# Altium project MICB.PrjPcb
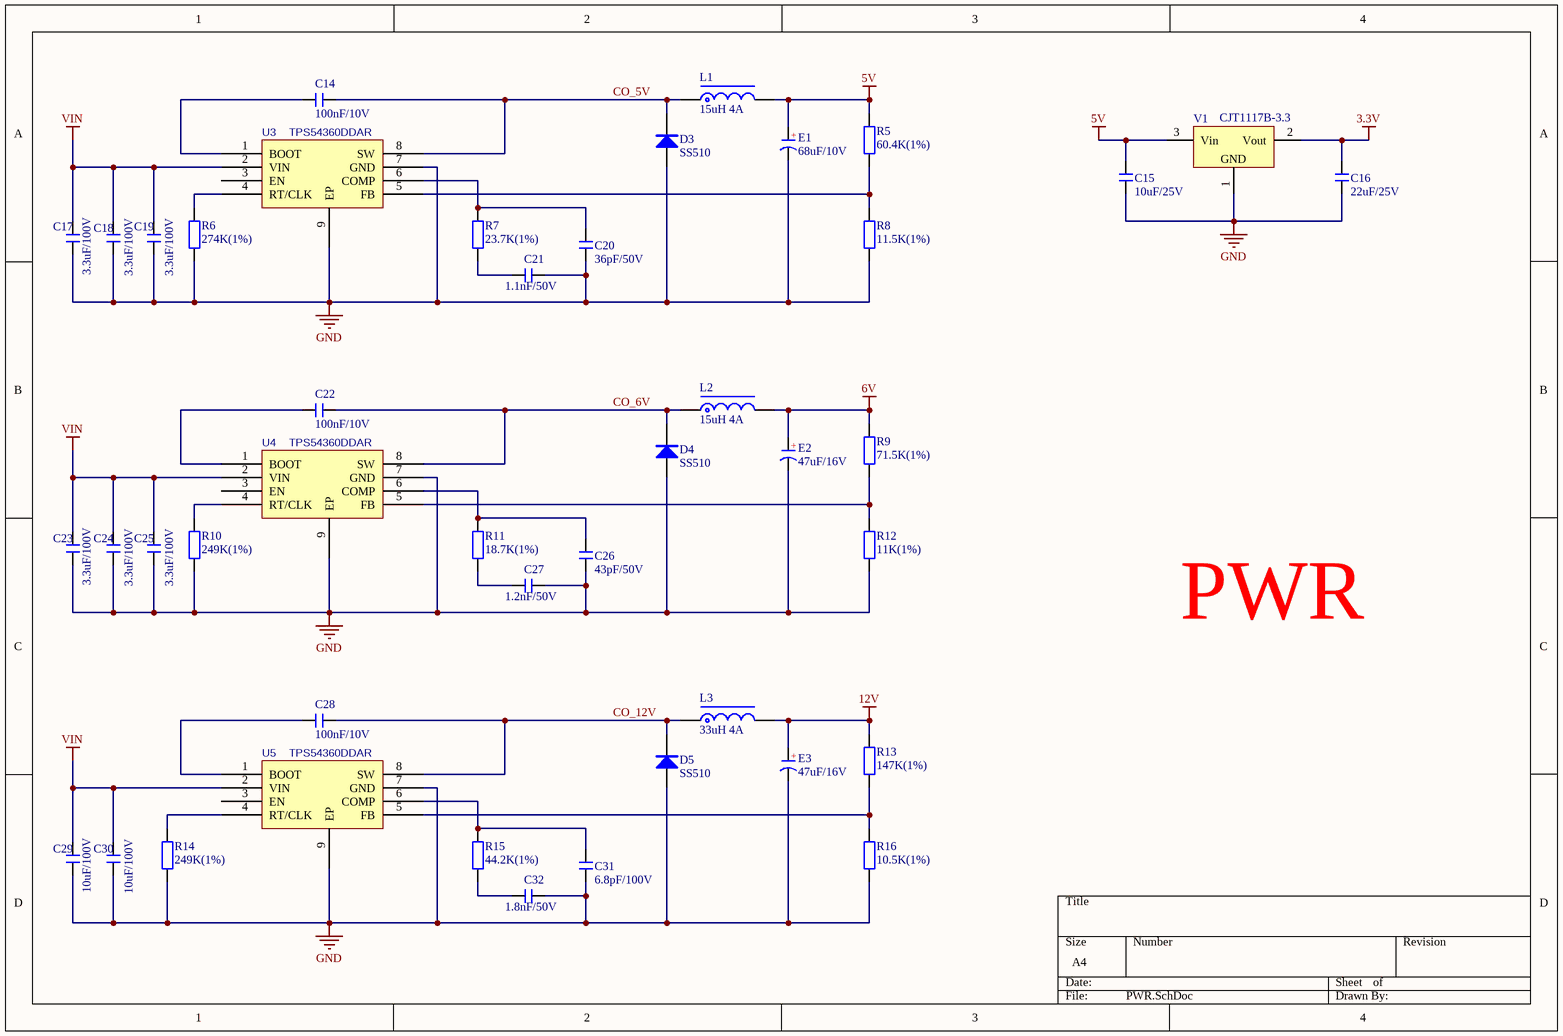
[diagram p0: PWR.SchDoc]
10 sheets, 244 parts. Net scope: global (net labels, ports and power ports of the same name join across sheets).
Board file: MICB.PcbDoc
Sheets:
  PWR.SchDoc
  MCU.SchDoc
  Vout.SchDoc
  Ain.SchDoc
  Iout.SchDoc
  PWM.SchDoc
  Serial.SchDoc
  RLY.SchDoc
  ETH.SchDoc
  CONN.SchDoc

## Sheet PWR.SchDoc
size A4; SheetNumber: 1; SheetTotal: 10

### Parts
C14  100nF/10V  [C 0603_L]
C15  10uF/25V  [C 0603_L]
C16  22uF/25V  [C 0603_L]
C17  3.3uF/100V  [C 1210_L]
C18  3.3uF/100V  [C 1210_L]
C19  3.3uF/100V  [C 1210_L]
C20  36pF/50V  [C 0603_L]
C21  1.1nF/50V  [C 0603_L]
C22  100nF/10V  [C 0603_L]
C23  3.3uF/100V  [C 1210_L]
C24  3.3uF/100V  [C 1210_L]
C25  3.3uF/100V  [C 1210_L]
C26  43pF/50V  [C 0603_L]
C27  1.2nF/50V  [C 0603_L]
C28  100nF/10V  [C 0603_L]
C29  10uF/100V  [C 1210_L]
C30  10uF/100V  [C 1210_L]
C31  6.8pF/100V  [C 0603_L]
C32  1.8nF/50V  [C 0603_L]
D3  SS510  [SMA]
D4  SS510  [SMA]
D5  SS510  [SMA]
E1  68uF/10V  [CD B(3528)]
E2  47uF/16V  [CD B(3528)]
E3  47uF/16V  [CD B(3528)]
L1  15uH 4A  [L-SMD-1040]
L2  15uH 4A  [L-SMD-1040]
L3  33uH 4A  [L-SMD-1040]
R5  60.4K(1%)  [R 0603_L]
R6  274K(1%)  [R 0603_L]
R7  23.7K(1%)  [R 0603_L]
R8  11.5K(1%)  [R 0603_L]
R9  71.5K(1%)  [R 0603_L]
R10  249K(1%)  [R 0603_L]
R11  18.7K(1%)  [R 0603_L]
R12  11K(1%)  [R 0603_L]
R13  147K(1%)  [R 0603_L]
R14  249K(1%)  [R 0603_L]
R15  44.2K(1%)  [R 0603_L]
R16  10.5K(1%)  [R 0603_L]
U3  TPS54360DDAR  [SOP-8EP]
U4  TPS54360DDAR  [SOP-8EP]
U5  TPS54360DDAR  [SOP-8EP]
V1  CJT1117B-3.3  [SOT223_L]

### Nets
3.3V: C16.2 V1.2(Vout)
5V: C15.2 E1.1(A) L1.2 R5.2 V1.3(Vin)
6V: E2.1(A) L2.2 R9.2
12V: E3.1(A) L3.2 R13.2
GND: C15.1 C16.1 C17.1 C18.1 C19.1 C20.2 C21.2 C23.1 C24.1 C25.1 C26.2 C27.2 C29.1 C30.1 C31.2 C32.2 D3.1(A) D4.1(A) D5.1(A) E1.2(K) E2.2(K) E3.2(K) R6.1 R8.1 R10.1 R12.1 R14.1 R16.1 U3.7(GND) U3.9(EP) U4.7(GND) U4.9(EP) U5.7(GND) U5.9(EP) V1.1(GND)
VIN: C17.2 C18.2 C19.2 C23.2 C24.2 C25.2 C29.2 C30.2 U3.2(VIN) U4.2(VIN) U5.2(VIN)
CO_5V: C14.1 D3.2(K) L1.1 U3.8(SW)
CO_6V: C22.1 D4.2(K) L2.1 U4.8(SW)
CO_12V: C28.1 D5.2(K) L3.1 U5.8(SW)
NetC14_2: C14.2 U3.1(BOOT)
NetC20_1: C20.1 R7.2 U3.6(COMP)
NetC21_1: C21.1 R7.1
NetC22_2: C22.2 U4.1(BOOT)
NetC26_1: C26.1 R11.2 U4.6(COMP)
NetC27_1: C27.1 R11.1
NetC28_2: C28.2 U5.1(BOOT)
NetC31_1: C31.1 R15.2 U5.6(COMP)
NetC32_1: C32.1 R15.1
NetR5_1: R5.1 R8.2 U3.5(FB)
NetR6_2: R6.2 U3.4(RT/CLK)
NetR9_1: R9.1 R12.2 U4.5(FB)
NetR10_2: R10.2 U4.4(RT/CLK)
NetR13_1: R13.1 R16.2 U5.5(FB)
NetR14_2: R14.2 U5.4(RT/CLK)

Not connected (* = marked no-connect by the designer): U3 3(EN); U4 3(EN); U5 3(EN)

### Notes on the sheet
- PWR
- (in symbol C-CD) +

### Library data of the parts
C14-C32 = C: 无极性贴片电容; 版权归属: 源创客; BOM名称: 无极性贴片电容; 学习资源: www.ooocke.com
D3-D5 = SS210: 肖特基二极管; 版权归属: 源创客; BOM名称: 肖特基二极管; 学习资源: www.ooocke.com
E1-E3 = C-CD: 贴片钽电容; 版权归属: 源创客; BOM名称: 贴片钽电容; 学习资源: www.ooocke.com
L1-L3 = L-CDRH: 一体成型电感; BOM名称: 功率屏蔽电感; 版权归属: 源创客; 学习资源: www.ooocke.com
R5-R16 = R: 贴片电阻; 版权归属: 源创客; BOM名称: 贴片电阻; 学习资源: www.ooocke.com
U3-U5 = TPS54360DDAR: BOM_Manufacturer: TI; BOM_Supplier: LCSC; BOM_Manufacturer Part: TPS54360DDAR; BOM_Supplier Part: C44377; BOM_JLCPCB Part Class: Extended Part; spicePre: U; spiceSymbolName: TPS54360DDAR
V1 = AMS1117: 三端稳压芯片; BOM名称: 稳压芯片; 版权归属: 源创客; 学习资源: www.ooocke.com

## Sheet MCU.SchDoc
size A4; SheetNumber: 2; SheetTotal: 10
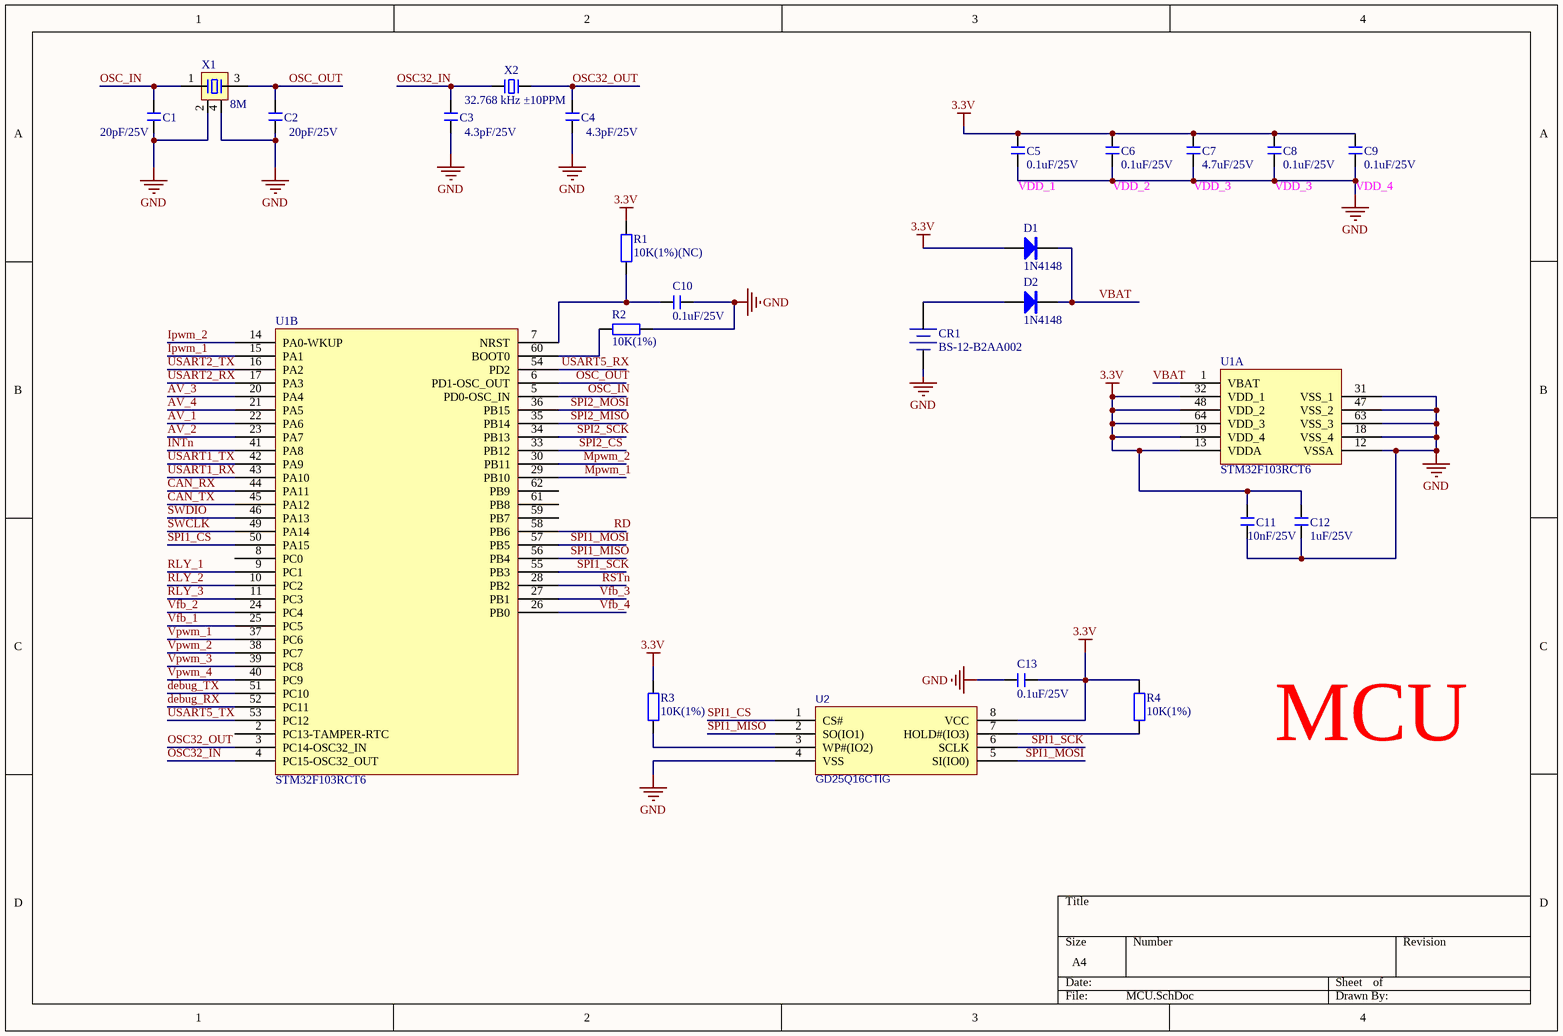
[diagram p1: MCU.SchDoc]

### Parts
C1  20pF/25V  [C 0603_L]
C2  20pF/25V  [C 0603_L]
C3  4.3pF/25V  [C 0603_L]
C4  4.3pF/25V  [C 0603_L]
C5  0.1uF/25V  [C 0603_L]
C6  0.1uF/25V  [C 0603_L]
C7  4.7uF/25V  [C 0603_L]
C8  0.1uF/25V  [C 0603_L]
C9  0.1uF/25V  [C 0603_L]
C10  0.1uF/25V  [C 0603_L]
C11  10nF/25V  [C 0603_L]
C12  1uF/25V  [C 0603_L]
C13  0.1uF/25V  [C 0603_L]
CR1  BS-12-B2AA002  [CR1220_B]
D1  1N4148  [SOD-323]
D2  1N4148  [SOD-323]
R1  10K(1%)(NC)  [R 0603_L]
R2  10K(1%)  [R 0603_L]
R3  10K(1%)  [R 0603_L]
R4  10K(1%)  [R 0603_L]
U1  STM32F103RCT6  [LQFP64 10x10_N]  (parts A,B of 2)
U2  GD25Q16CTIG  [SOP-8]
X1  8M  [OSC 3225-4P]
X2  32.768 kHz ±10PPM  [OSC 3215-2P]

### Nets
3.3V: C5.2 C6.2 C7.2 C8.2 C9.2 C11.1 C12.1 C13.2 D1.1(A) R1.2 R3.1 R4.1 U1.13(VDDA) U1.19(VDD_4) U1.32(VDD_1) U1.48(VDD_2) U1.64(VDD_3) U2.8(VCC)
GND: C1.2 C2.2 C3.2 C4.2 C5.1 C6.1 C7.1 C8.1 C9.1 C10.1 C11.2 C12.2 C13.1 CR1.2(DC-) R2.1 U1.12(VSSA) U1.18(VSS_4) U1.31(VSS_1) U1.47(VSS_2) U1.63(VSS_3) U2.4(VSS) X1.2 X1.4
AV_1: U1.22(PA6)
AV_2: U1.23(PA7)
AV_3: U1.20(PA4)
AV_4: U1.21(PA5)
CAN_RX: U1.44(PA11)
CAN_TX: U1.45(PA12)
debug_RX: U1.52(PC11)
debug_TX: U1.51(PC10)
INTn: U1.41(PA8)
Ipwm_1: U1.15(PA1)
Ipwm_2: U1.14(PA0-WKUP)
Mpwm_1: U1.29(PB10)
Mpwm_2: U1.30(PB11)
OSC32_IN: C3.1 U1.4(PC15-OSC32_OUT) X2.1
OSC32_OUT: C4.1 U1.3(PC14-OSC32_IN) X2.2
OSC_IN: C1.1 U1.5(PD0-OSC_IN) X1.1
OSC_OUT: C2.1 U1.6(PD1-OSC_OUT) X1.3
RD: U1.58(PB6)
RLY_1: U1.9(PC1)
RLY_2: U1.10(PC2)
RLY_3: U1.11(PC3)
RSTn: U1.28(PB2)
SPI1_CS: U1.50(PA15) U2.1(CS#)
SPI1_MISO: U1.56(PB4) U2.2(SO(IO1))
SPI1_MOSI: U1.57(PB5) U2.5(SI(IO0))
SPI1_SCK: U1.55(PB3) U2.6(SCLK)
SPI2_CS: U1.33(PB12)
SPI2_MISO: U1.35(PB14)
SPI2_MOSI: U1.36(PB15)
SPI2_SCK: U1.34(PB13)
SWCLK: U1.49(PA14)
SWDIO: U1.46(PA13)
USART1_RX: U1.43(PA10)
USART1_TX: U1.42(PA9)
USART2_RX: U1.17(PA3)
USART2_TX: U1.16(PA2)
USART5_RX: U1.54(PD2)
USART5_TX: U1.53(PC12)
VBAT: D1.2(K) D2.2(K) U1.1(VBAT)
Vfb_1: U1.25(PC5)
Vfb_2: U1.24(PC4)
Vfb_3: U1.27(PB1)
Vfb_4: U1.26(PB0)
Vpwm_1: U1.37(PC6)
Vpwm_2: U1.38(PC7)
Vpwm_3: U1.39(PC8)
Vpwm_4: U1.40(PC9)
NetC10_2: C10.2 R1.1 U1.7(NRST)
NetCR1_1: CR1.1(DC+) D2.1(A)
NetR2_2: R2.2 U1.60(BOOT0)
NetR3_2: R3.2 U2.3(WP#(IO2))
NetR4_2: R4.2 U2.7(HOLD#(IO3))

Not connected (* = marked no-connect by the designer): U1 2(PC13-TAMPER-RTC) 8(PC0) 59(PB7) 61(PB8) 62(PB9)

### Notes on the sheet
- (near C5) VDD_1
- (near C6) VDD_2
- (near C7) VDD_3
- (near C8) VDD_3
- (near C9) VDD_4
- MCU

### Library data of the parts
C1-C13 = C: 无极性贴片电容; 版权归属: 源创客; BOM名称: 无极性贴片电容; 学习资源: www.ooocke.com
CR1 = CR-3V: MYOUNG(美阳) 电池底座 适用电池:CR1220; BOM名称: 微型电池; 版权归属: 源创客; 学习资源: www.ooocke.com
D1 D2 = 1N4148: 高速开关二极管; 版权归属: 源创客; BOM名称: 高速开关二极管; 学习资源: www.ooocke.com
R1-R4 = R: 贴片电阻; 版权归属: 源创客; BOM名称: 贴片电阻; 学习资源: www.ooocke.com
U2 = GD25Q16CTIG: spi flash; BOM_Manufacturer: XTX; BOM_Manufacturer Part: XT25F32BSOIGU-S; Contributor: LCSC; BOM_Supplier: LCSC; BOM_Supplier Part: C558851; BOM_JLCPCB Part Class: Extended Part; spicePre: U; spiceSymbolName: XT25F32BSOIGU-S
X1 = XTAL-4P: 4脚无源晶振; 版权归属: 源创客; BOM名称: 4脚无源晶振; 学习资源: www.ooocke.com
X2 = XTAL-2P: 2脚无源脚晶振 型号Q13FC13500005; 版权归属: 源创客; BOM名称: 2脚无源脚晶振; 学习资源: www.ooocke.com

## Sheet Vout.SchDoc
size A4; SheetNumber: 3; SheetTotal: 10
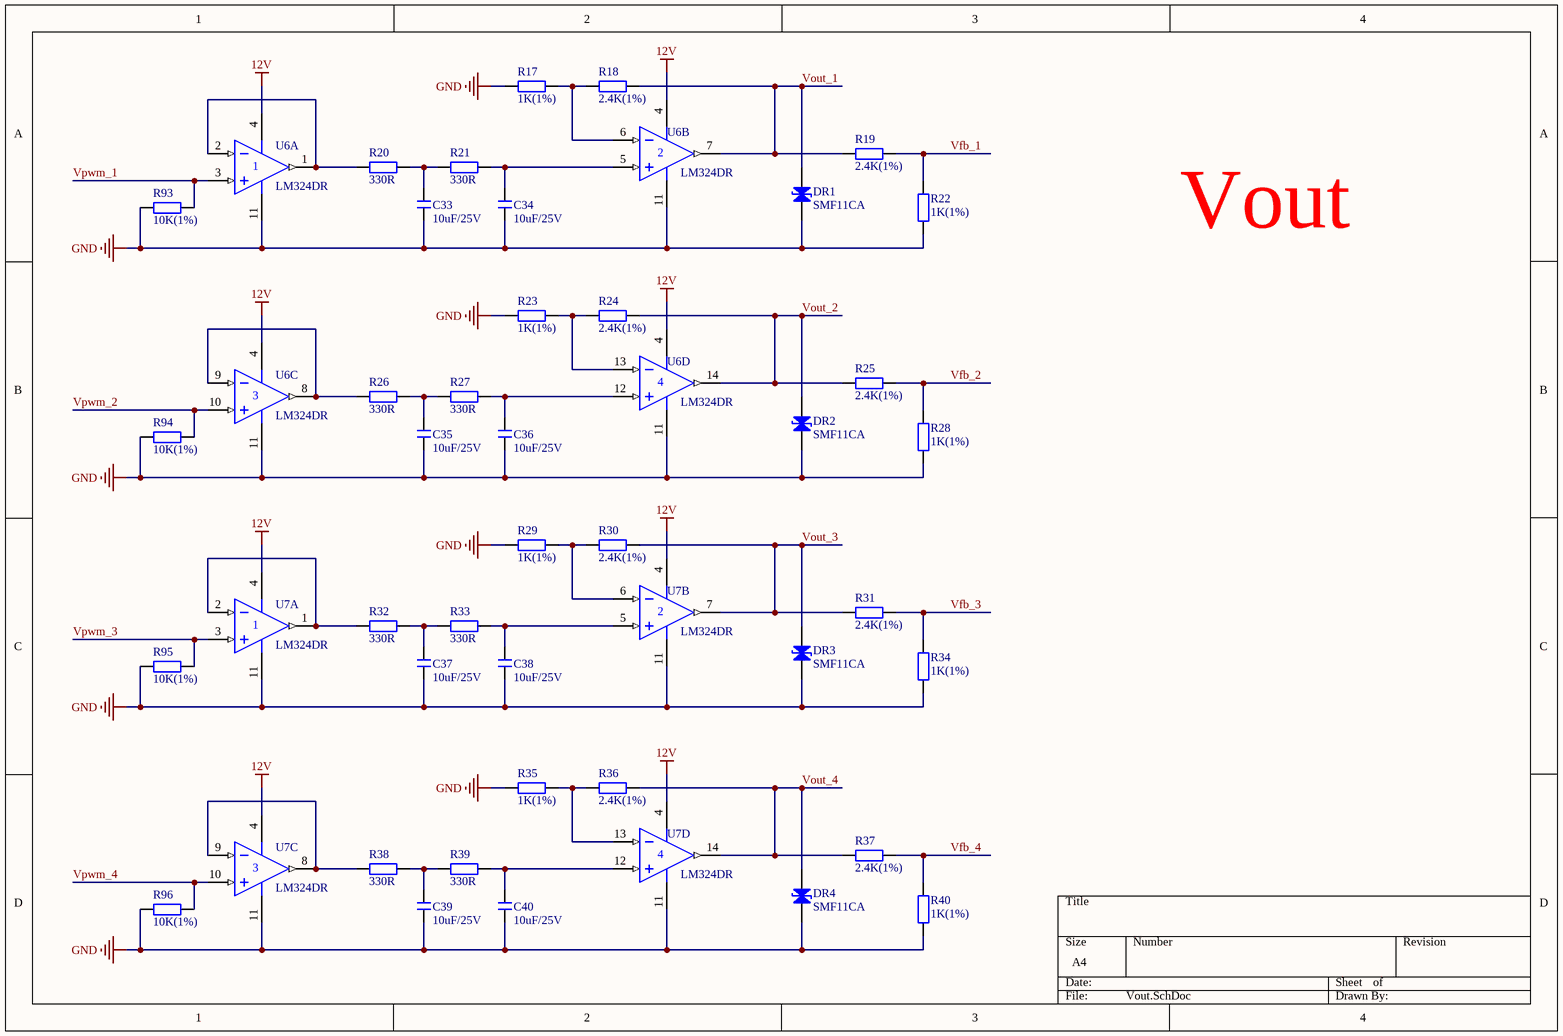
[diagram p2: Vout.SchDoc]

### Parts
C33  10uF/25V  [C 0603_L]
C34  10uF/25V  [C 0603_L]
C35  10uF/25V  [C 0603_L]
C36  10uF/25V  [C 0603_L]
C37  10uF/25V  [C 0603_L]
C38  10uF/25V  [C 0603_L]
C39  10uF/25V  [C 0603_L]
C40  10uF/25V  [C 0603_L]
DR1  SMF11CA  [SOD-123F]
DR2  SMF11CA  [SOD-123F]
DR3  SMF11CA  [SOD-123F]
DR4  SMF11CA  [SOD-123F]
R17  1K(1%)  [R 0603_L]
R18  2.4K(1%)  [R 0603_L]
R19  2.4K(1%)  [R 0603_L]
R20  330R  [R 0603_L]
R21  330R  [R 0603_L]
R22  1K(1%)  [R 0603_L]
R23  1K(1%)  [R 0603_L]
R24  2.4K(1%)  [R 0603_L]
R25  2.4K(1%)  [R 0603_L]
R26  330R  [R 0603_L]
R27  330R  [R 0603_L]
R28  1K(1%)  [R 0603_L]
R29  1K(1%)  [R 0603_L]
R30  2.4K(1%)  [R 0603_L]
R31  2.4K(1%)  [R 0603_L]
R32  330R  [R 0603_L]
R33  330R  [R 0603_L]
R34  1K(1%)  [R 0603_L]
R35  1K(1%)  [R 0603_L]
R36  2.4K(1%)  [R 0603_L]
R37  2.4K(1%)  [R 0603_L]
R38  330R  [R 0603_L]
R39  330R  [R 0603_L]
R40  1K(1%)  [R 0603_L]
R93  10K(1%)  [R 0603_L]
R94  10K(1%)  [R 0603_L]
R95  10K(1%)  [R 0603_L]
R96  10K(1%)  [R 0603_L]
U6  LM324DR  [D014_N]  (parts A,B,C,D of 4)
U7  LM324DR  [D014_N]  (parts A,B,C,D of 4)

### Nets
12V: U6.4(V+) U7.4(V+)
GND: C33.1 C34.1 C35.1 C36.1 C37.1 C38.1 C39.1 C40.1 DR1.2(K) DR2.2(K) DR3.2(K) DR4.2(K) R17.2 R22.1 R23.2 R28.1 R29.2 R34.1 R35.2 R40.1 R93.1 R94.1 R95.1 R96.1 U6.11(V-) U7.11(V-)
Vfb_1: R19.1 R22.2
Vfb_2: R25.1 R28.2
Vfb_3: R31.1 R34.2
Vfb_4: R37.1 R40.2
Vout_1: DR1.1(A) R18.1 R19.2 U6.7(OUT)
Vout_2: DR2.1(A) R24.1 R25.2 U6.14(OUT)
Vout_3: DR3.1(A) R30.1 R31.2 U7.7(OUT)
Vout_4: DR4.1(A) R36.1 R37.2 U7.14(OUT)
Vpwm_1: R93.2 U6.3(IN+)
Vpwm_2: R94.2 U6.10(IN+)
Vpwm_3: R95.2 U7.3(IN+)
Vpwm_4: R96.2 U7.10(IN+)
NetC33_2: C33.2 R20.1 R21.2
NetC34_2: C34.2 R21.1 U6.5(IN+)
NetC35_2: C35.2 R26.1 R27.2
NetC36_2: C36.2 R27.1 U6.12(IN+)
NetC37_2: C37.2 R32.1 R33.2
NetC38_2: C38.2 R33.1 U7.5(IN+)
NetC39_2: C39.2 R38.1 R39.2
NetC40_2: C40.2 R39.1 U7.12(IN+)
NetR17_1: R17.1 R18.2 U6.6(IN-)
NetR20_2: R20.2 U6.1(OUT) U6.2(IN-)
NetR23_1: R23.1 R24.2 U6.13(IN-)
NetR26_2: R26.2 U6.8(OUT) U6.9(IN-)
NetR29_1: R29.1 R30.2 U7.6(IN-)
NetR32_2: R32.2 U7.1(OUT) U7.2(IN-)
NetR35_1: R35.1 R36.2 U7.13(IN-)
NetR38_2: R38.2 U7.8(OUT) U7.9(IN-)

### Notes on the sheet
- Vout

### Library data of the parts
C33-C40 = C: 无极性贴片电容; 版权归属: 源创客; BOM名称: 无极性贴片电容; 学习资源: www.ooocke.com
DR1-DR4 = DR: 瞬态电压抑制二极管; 版权归属: 源创客; BOM名称: 瞬态电压抑制二极管; 学习资源: www.ooocke.com
R17-R40 R93-R96 = R: 贴片电阻; 版权归属: 源创客; BOM名称: 贴片电阻; 学习资源: www.ooocke.com
U6 U7 = LM324DR: Quadruple Operational Amplifier; Published: 15-Apr-2002; LatestRevisionDate: 13-Apr-2006; LatestRevisionNote: IPC-7351 Footprint Added.; DatasheetVersion: Jan-1989; PackageVersion: Jan-1998; PackageReference: D014; Publisher: Altium Limited; PackageDescription: 14-Pin Small Outline Integrated Circuit 1.27 mm Pitch; Code_IPC: SOIC127P600-14; ComponentLink1Description: Manufacturer Link; ComponentLink1URL: http://www.ti.com/; ComponentLink2Description: Datasheet; ComponentLink2URL: http://www-s.ti.com/sc/ds/lm324.pdf

## Sheet Ain.SchDoc
size A4; SheetNumber: 4; SheetTotal: 10
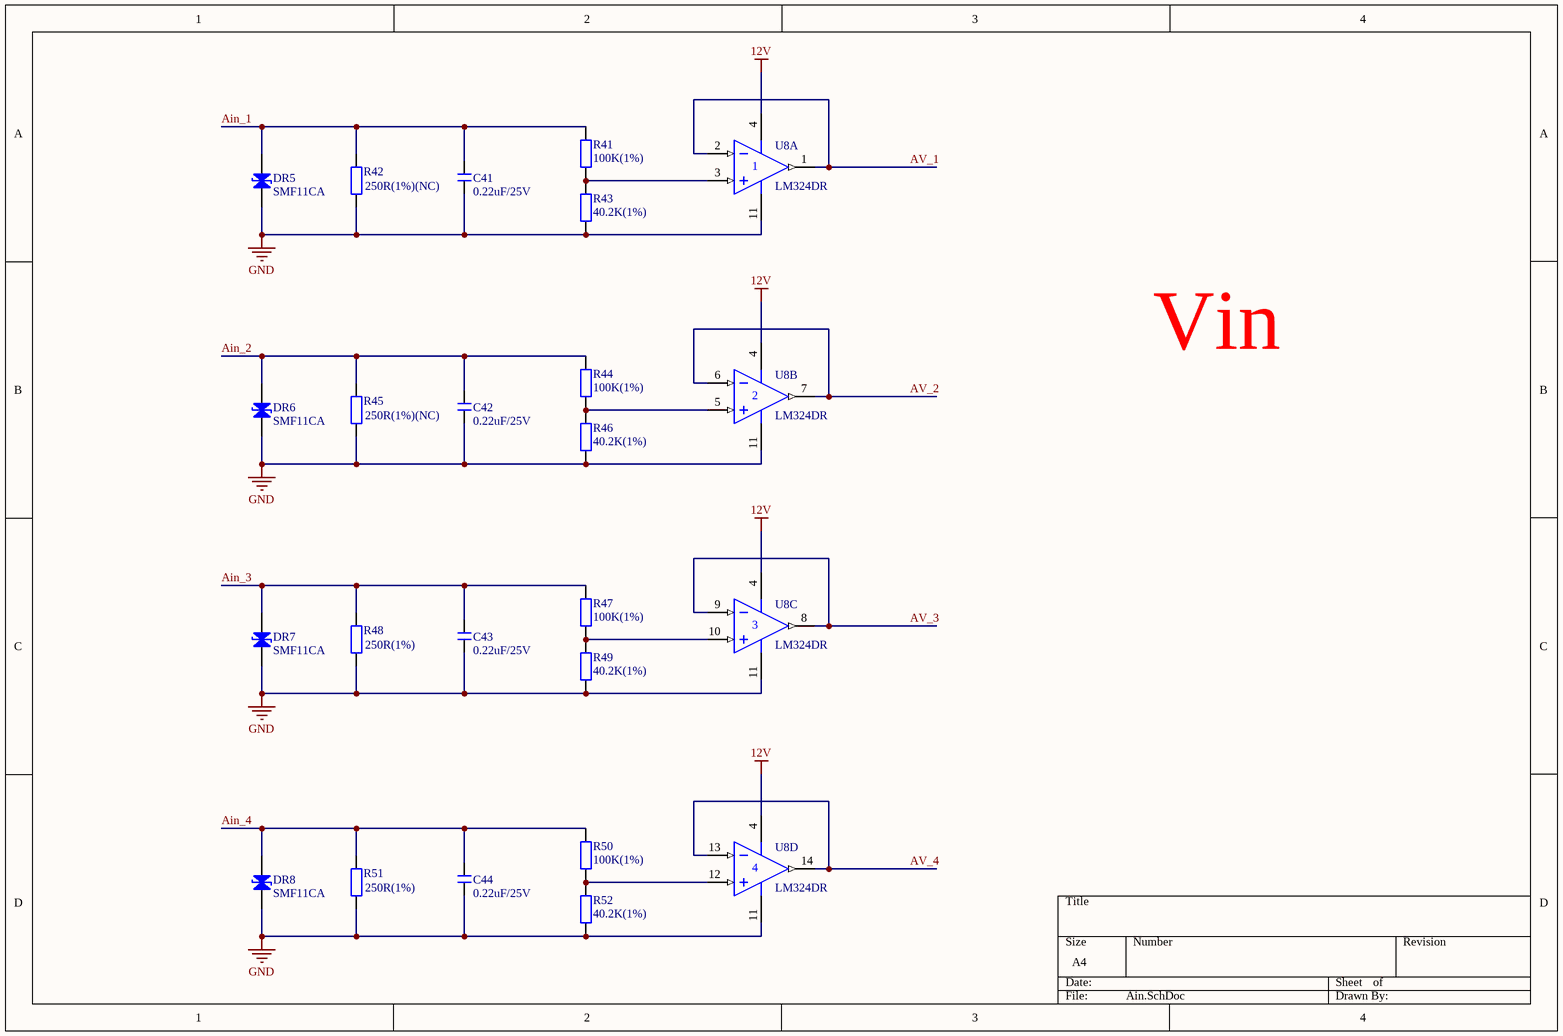
[diagram p3: Ain.SchDoc]

### Parts
C41  0.22uF/25V  [C 0603_L]
C42  0.22uF/25V  [C 0603_L]
C43  0.22uF/25V  [C 0603_L]
C44  0.22uF/25V  [C 0603_L]
DR5  SMF11CA  [SOD-123F]
DR6  SMF11CA  [SOD-123F]
DR7  SMF11CA  [SOD-123F]
DR8  SMF11CA  [SOD-123F]
R41  100K(1%)  [R 0603_L]
R42  250R(1%)(NC)  [R 0603_L]
R43  40.2K(1%)  [R 0603_L]
R44  100K(1%)  [R 0603_L]
R45  250R(1%)(NC)  [R 0603_L]
R46  40.2K(1%)  [R 0603_L]
R47  100K(1%)  [R 0603_L]
R48  250R(1%)  [R 0603_L]
R49  40.2K(1%)  [R 0603_L]
R50  100K(1%)  [R 0603_L]
R51  250R(1%)  [R 0603_L]
R52  40.2K(1%)  [R 0603_L]
U8  LM324DR  [D014_N]  (parts A,B,C,D of 4)

### Nets
12V: U8.4(V+)
GND: C41.1 C42.1 C43.1 C44.1 DR5.2(K) DR6.2(K) DR7.2(K) DR8.2(K) R42.1 R43.1 R45.1 R46.1 R48.1 R49.1 R51.1 R52.1 U8.11(V-)
Ain_1: C41.2 DR5.1(A) R41.2 R42.2
Ain_2: C42.2 DR6.1(A) R44.2 R45.2
Ain_3: C43.2 DR7.1(A) R47.2 R48.2
Ain_4: C44.2 DR8.1(A) R50.2 R51.2
AV_1: U8.1(OUT) U8.2(IN-)
AV_2: U8.6(IN-) U8.7(OUT)
AV_3: U8.8(OUT) U8.9(IN-)
AV_4: U8.13(IN-) U8.14(OUT)
NetR41_1: R41.1 R43.2 U8.3(IN+)
NetR44_1: R44.1 R46.2 U8.5(IN+)
NetR47_1: R47.1 R49.2 U8.10(IN+)
NetR50_1: R50.1 R52.2 U8.12(IN+)

### Notes on the sheet
- Vin

### Library data of the parts
C41-C44 = C: 无极性贴片电容; 版权归属: 源创客; BOM名称: 无极性贴片电容; 学习资源: www.ooocke.com
DR5-DR8 = DR: 瞬态电压抑制二极管; 版权归属: 源创客; BOM名称: 瞬态电压抑制二极管; 学习资源: www.ooocke.com
R41-R52 = R: 贴片电阻; 版权归属: 源创客; BOM名称: 贴片电阻; 学习资源: www.ooocke.com
U8 = LM324DR: Quadruple Operational Amplifier; Published: 15-Apr-2002; LatestRevisionDate: 13-Apr-2006; LatestRevisionNote: IPC-7351 Footprint Added.; DatasheetVersion: Jan-1989; PackageVersion: Jan-1998; PackageReference: D014; Publisher: Altium Limited; PackageDescription: 14-Pin Small Outline Integrated Circuit 1.27 mm Pitch; Code_IPC: SOIC127P600-14; ComponentLink1Description: Manufacturer Link; ComponentLink1URL: http://www.ti.com/; ComponentLink2Description: Datasheet; ComponentLink2URL: http://www-s.ti.com/sc/ds/lm324.pdf

## Sheet Iout.SchDoc
size A4; SheetNumber: 5; SheetTotal: 10
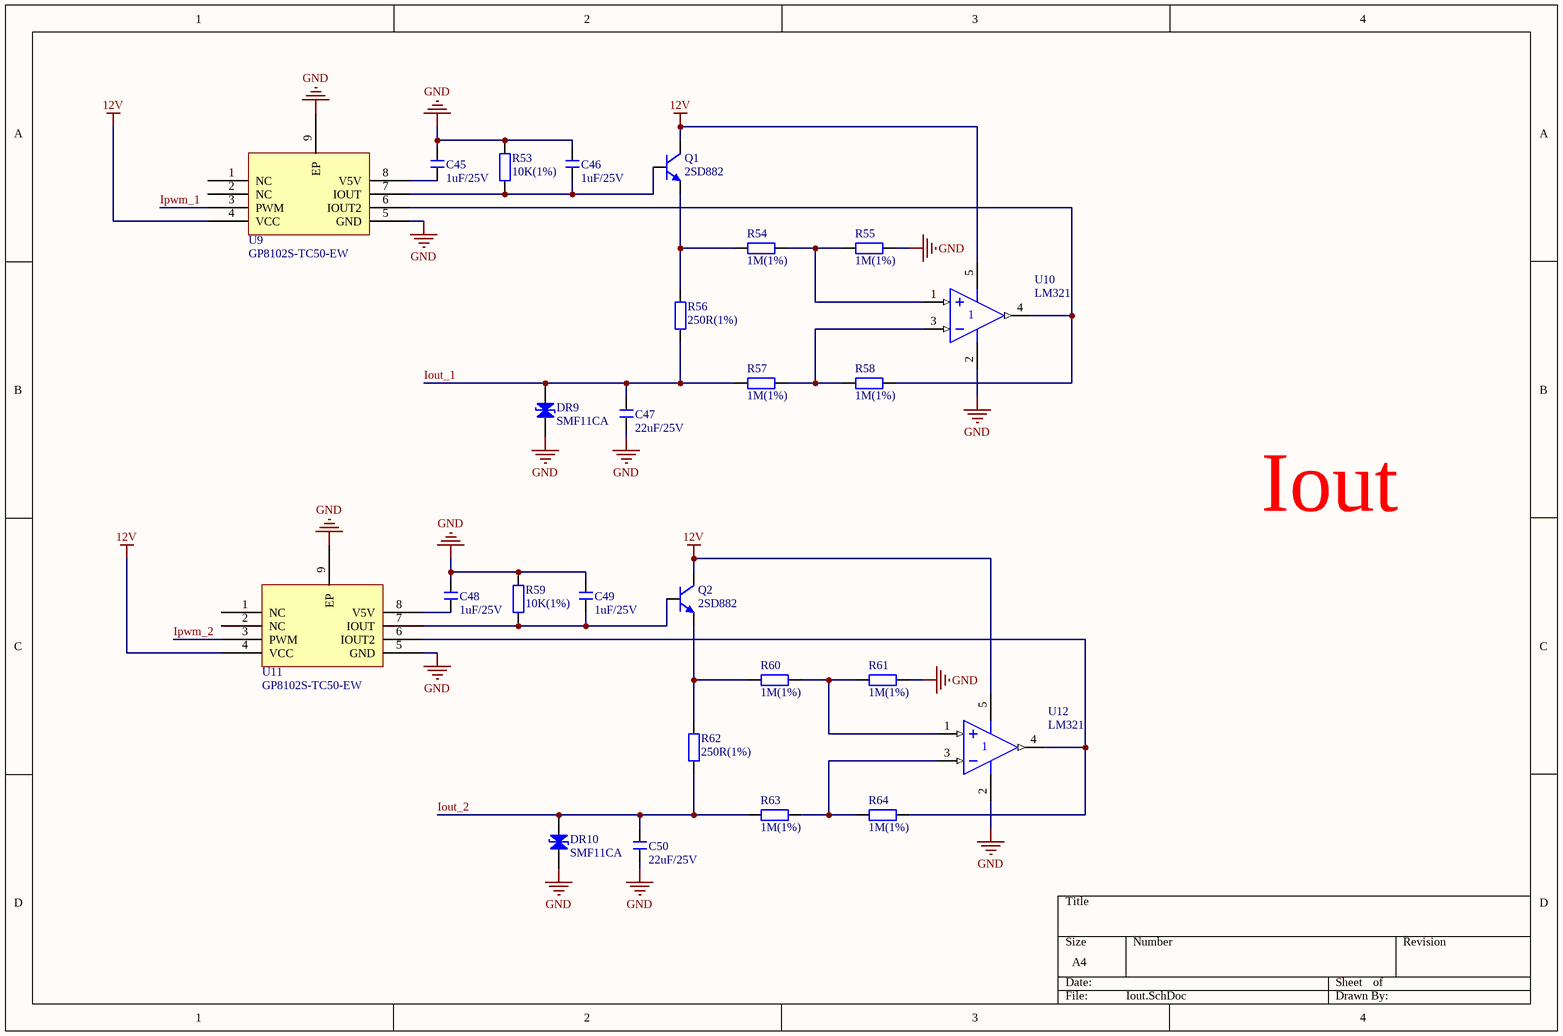
[diagram p4: Iout.SchDoc]

### Parts
C45  1uF/25V  [C 0603_L]
C46  1uF/25V  [C 0603_L]
C47  22uF/25V  [C 0603_L]
C48  1uF/25V  [C 0603_L]
C49  1uF/25V  [C 0603_L]
C50  22uF/25V  [C 0603_L]
DR9  SMF11CA  [SOD-123F]
DR10  SMF11CA  [SOD-123F]
Q1  2SD882  [SOT89_N]
Q2  2SD882  [SOT89_N]
R53  10K(1%)  [R 0603_L]
R54  1M(1%)  [R 0603_L]
R55  1M(1%)  [R 0603_L]
R56  250R(1%)  [R 0603_L]
R57  1M(1%)  [R 0603_L]
R58  1M(1%)  [R 0603_L]
R59  10K(1%)  [R 0603_L]
R60  1M(1%)  [R 0603_L]
R61  1M(1%)  [R 0603_L]
R62  250R(1%)  [R 0603_L]
R63  1M(1%)  [R 0603_L]
R64  1M(1%)  [R 0603_L]
U9  GP8102S-TC50-EW  [ESOP8_N]
U10  LM321  [SOT23-5N]
U11  GP8102S-TC50-EW  [ESOP8_N]
U12  LM321  [SOT23-5N]

### Nets
12V: Q1.2(C) Q2.2(C) U9.4(VCC) U10.5(V+) U11.4(VCC) U12.5(V+)
GND: C45.2 C46.2 C47.2 C48.2 C49.2 C50.2 DR9.2(K) DR10.2(K) R53.2 R55.2 R59.2 R61.2 U9.5(GND) U9.9(EP) U10.2(V-) U11.5(GND) U11.9(EP) U12.2(V-)
Iout_1: C47.1 DR9.1(A) R56.2 R57.1
Iout_2: C50.1 DR10.1(A) R62.2 R63.1
Ipwm_1: U9.3(PWM)
Ipwm_2: U11.3(PWM)
NetC45_1: C45.1 U9.8(V5V)
NetC46_1: C46.1 Q1.1(B) R53.1 U9.7(IOUT)
NetC48_1: C48.1 U11.8(V5V)
NetC49_1: C49.1 Q2.1(B) R59.1 U11.7(IOUT)
NetQ1_3: Q1.3(E) R54.1 R56.1
NetQ2_3: Q2.3(E) R60.1 R62.1
NetR54_2: R54.2 R55.1 U10.1(IN+)
NetR57_2: R57.2 R58.1 U10.3(IN-)
NetR58_2: R58.2 U9.6(IOUT2) U10.4(OUT)
NetR60_2: R60.2 R61.1 U12.1(IN+)
NetR63_2: R63.2 R64.1 U12.3(IN-)
NetR64_2: R64.2 U11.6(IOUT2) U12.4(OUT)

Not connected (* = marked no-connect by the designer): U9 1(NC) 2(NC); U11 1(NC) 2(NC)

### Notes on the sheet
- Iout

### Library data of the parts
C45-C50 = C: 无极性贴片电容; 版权归属: 源创客; BOM名称: 无极性贴片电容; 学习资源: www.ooocke.com
DR9 DR10 = DR: 瞬态电压抑制二极管; 版权归属: 源创客; BOM名称: 瞬态电压抑制二极管; 学习资源: www.ooocke.com
Q1 Q2 = D882-SMD: 音频功放-NPN型; 版权归属: 源创客; 属性: 40V 3A 30W; BOM名称: 音频功放-NPN型; 学习资源: www.ooocke.com
R53-R64 = R: 贴片电阻; 版权归属: 源创客; BOM名称: 贴片电阻; 学习资源: www.ooocke.com

## Sheet PWM.SchDoc
size A4; SheetNumber: 6; SheetTotal: 10
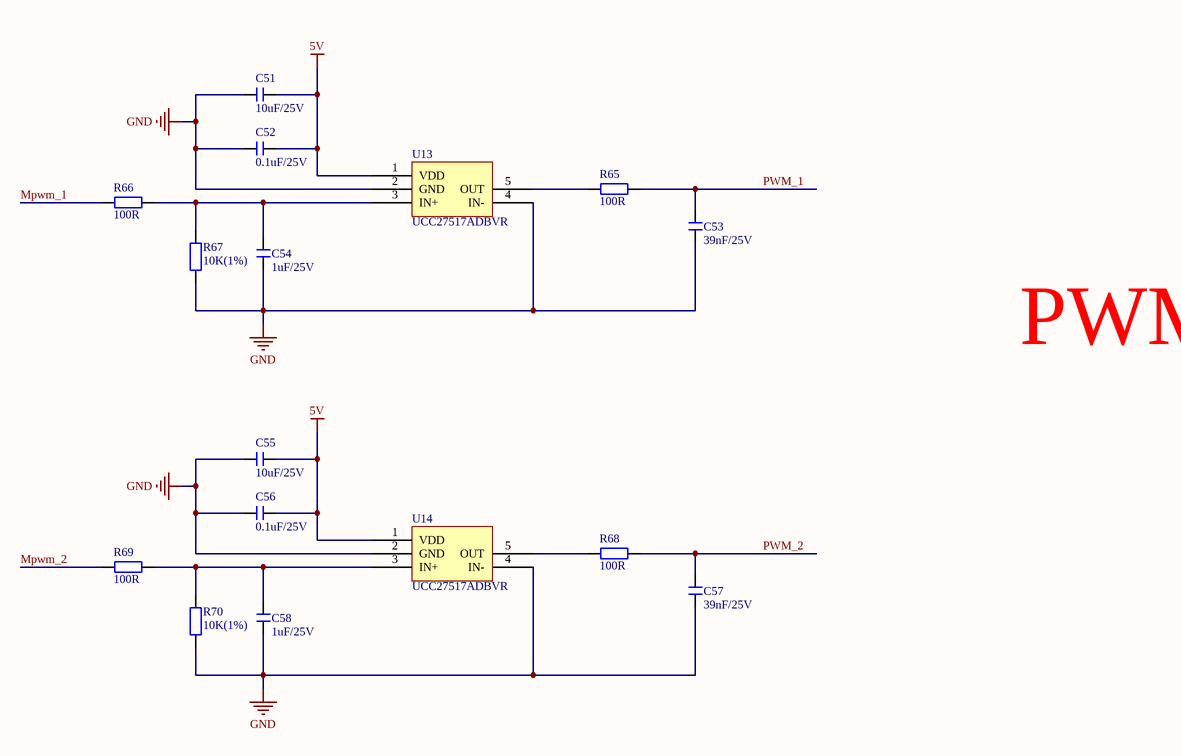
[diagram p5: PWM.SchDoc]

### Parts
C51  10uF/25V  [C 0603_L]
C52  0.1uF/25V  [C 0603_L]
C53  39nF/25V  [C 0603_L]
C54  1uF/25V  [C 0603_L]
C55  10uF/25V  [C 0603_L]
C56  0.1uF/25V  [C 0603_L]
C57  39nF/25V  [C 0603_L]
C58  1uF/25V  [C 0603_L]
R65  100R  [R 0603_L]
R66  100R  [R 0603_L]
R67  10K(1%)  [R 0603_L]
R68  100R  [R 0603_L]
R69  100R  [R 0603_L]
R70  10K(1%)  [R 0603_L]
U13  UCC27517ADBVR  [SOT23-5N]
U14  UCC27517ADBVR  [SOT23-5N]

### Nets
5V: C51.1 C52.1 C55.1 C56.1 U13.1(VDD) U14.1(VDD)
GND: C51.2 C52.2 C53.1 C54.1 C55.2 C56.2 C57.1 C58.1 R67.2 R70.2 U13.2(GND) U13.4(IN-) U14.2(GND) U14.4(IN-)
Mpwm_1: R66.2
Mpwm_2: R69.2
PWM_1: C53.2 R65.1
PWM_2: C57.2 R68.1
NetC54_2: C54.2 R66.1 R67.1 U13.3(IN+)
NetC58_2: C58.2 R69.1 R70.1 U14.3(IN+)
NetR65_2: R65.2 U13.5(OUT)
NetR68_2: R68.2 U14.5(OUT)

### Notes on the sheet
- PWM

### Library data of the parts
C51-C58 = C: 无极性贴片电容; 版权归属: 源创客; BOM名称: 无极性贴片电容; 学习资源: www.ooocke.com
R65-R70 = R: 贴片电阻; 版权归属: 源创客; BOM名称: 贴片电阻; 学习资源: www.ooocke.com

## Sheet Serial.SchDoc
size A4; SheetNumber: 7; SheetTotal: 10
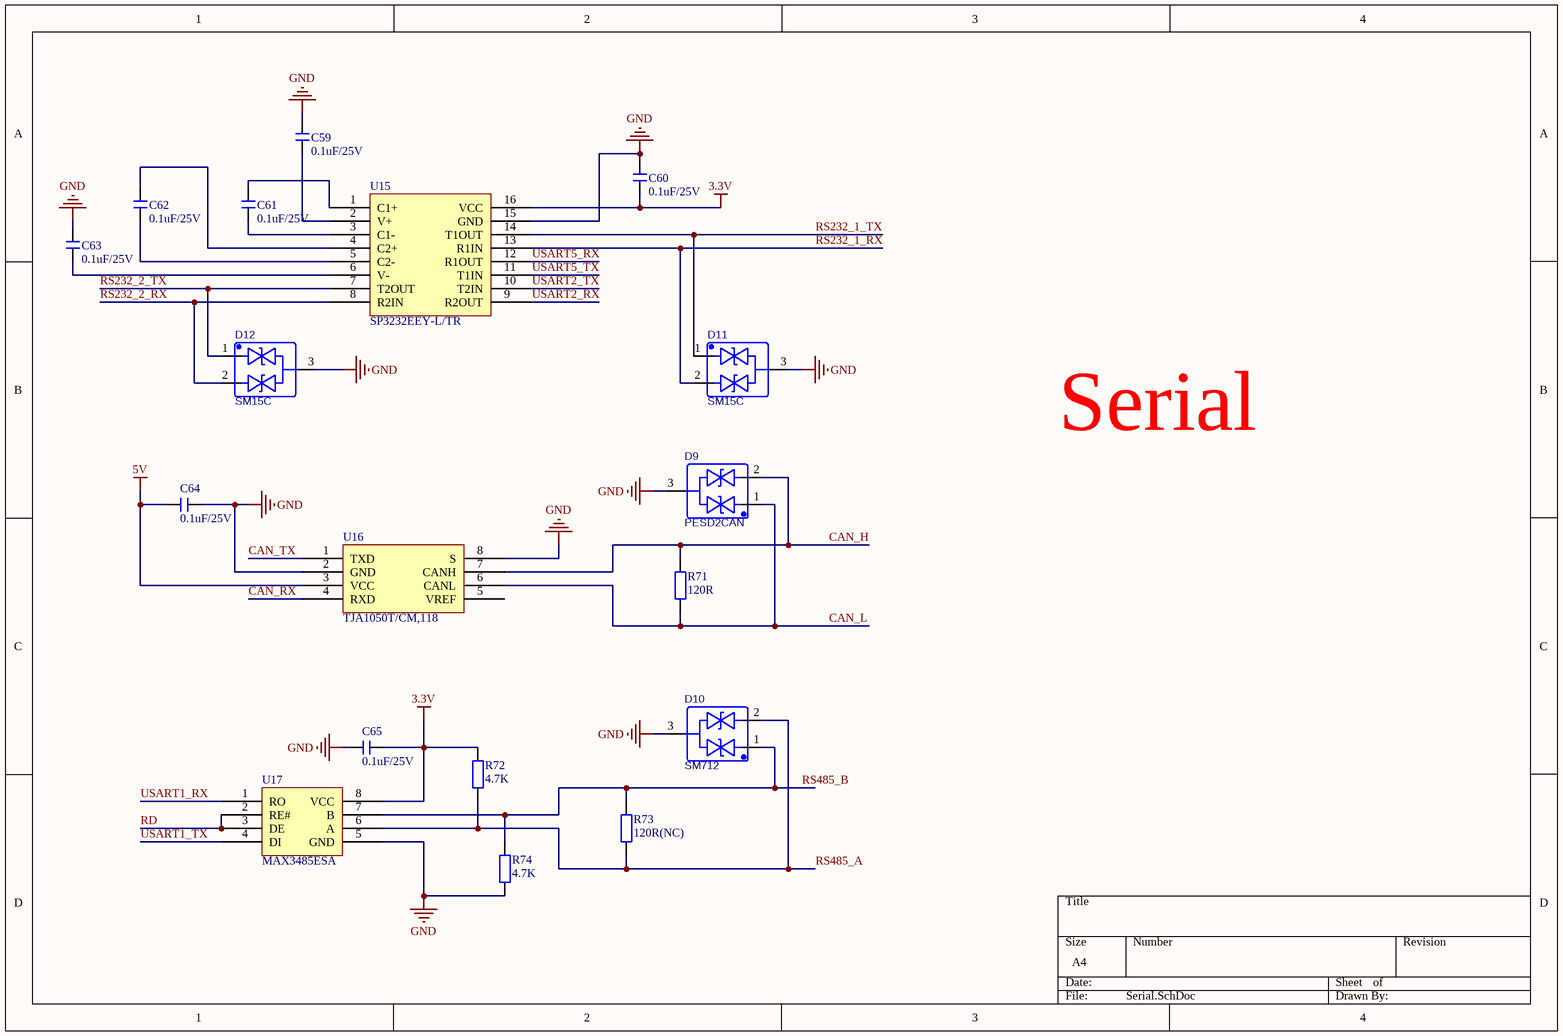
[diagram p6: Serial.SchDoc]

### Parts
C59  0.1uF/25V  [C 0603_L]
C60  0.1uF/25V  [C 0603_L]
C61  0.1uF/25V  [C 0603_L]
C62  0.1uF/25V  [C 0603_L]
C63  0.1uF/25V  [C 0603_L]
C64  0.1uF/25V  [C 0603_L]
C65  0.1uF/25V  [C 0603_L]
D9  PESD2CAN  [SOT23-3N]
D10  SM712  [SOT23-3N]
D11  SM15C  [SOT23-3N]
D12  SM15C  [SOT23-3N]
R71  120R  [R 0603_L]
R72  4.7K  [R 0603_L]
R73  120R(NC)  [R 0603_L]
R74  4.7K  [R 0603_L]
U15  SP3232EEY-L/TR  [TSSOP16_N]
U16  TJA1050T/CM,118  [SOP-8]
U17  MAX3485ESA  [SOP-8]

### Nets
3.3V: C60.1 C65.1 R72.2 U15.16(VCC) U17.8(VCC)
5V: C64.1 U16.3(VCC)
GND: C59.2 C60.2 C63.2 C64.2 C65.2 D9.3 D10.3 D11.3 D12.3 R74.1 U15.15(GND) U16.2(GND) U16.8(S) U17.5(GND)
CAN_H: D9.2 R71.2 U16.7(CANH)
CAN_L: D9.1 R71.1 U16.6(CANL)
CAN_RX: U16.4(RXD)
CAN_TX: U16.1(TXD)
RD: U17.2(RE#) U17.3(DE)
RS232_1_RX: D11.2 U15.13(R1IN)
RS232_1_TX: D11.1 U15.14(T1OUT)
RS232_2_RX: D12.2 U15.8(R2IN)
RS232_2_TX: D12.1 U15.7(T2OUT)
RS485_A: D10.2 R72.1 R73.1 U17.6(A)
RS485_B: D10.1 R73.2 R74.2 U17.7(B)
USART1_RX: U17.1(RO)
USART1_TX: U17.4(DI)
USART2_RX: U15.9(R2OUT)
USART2_TX: U15.10(T2IN)
USART5_RX: U15.12(R1OUT)
USART5_TX: U15.11(T1IN)
NetC59_1: C59.1 U15.2(V+)
NetC61_1: C61.1 U15.3(C1-)
NetC61_2: C61.2 U15.1(C1+)
NetC62_1: C62.1 U15.5(C2-)
NetC62_2: C62.2 U15.4(C2+)
NetC63_1: C63.1 U15.6(V-)

Not connected (* = marked no-connect by the designer): U16 5(VREF)

### Notes on the sheet
- Serial

### Library data of the parts
C59-C65 = C: 无极性贴片电容; 版权归属: 源创客; BOM名称: 无极性贴片电容; 学习资源: www.ooocke.com
D9-D12 = PESD2CAN: BOM_Manufacturer: DOWO; Contributor: LCSC; BOM_Supplier: LCSC; BOM_Supplier Part: C284078; BOM_Manufacturer Part: PESD2CAN; BOM_JLCPCB Part Class: Extended Part; spicePre: D; spiceSymbolName: PESD2CAN
R71-R74 = R: 贴片电阻; 版权归属: 源创客; BOM名称: 贴片电阻; 学习资源: www.ooocke.com

## Sheet RLY.SchDoc
size A4; SheetNumber: 8; SheetTotal: 10
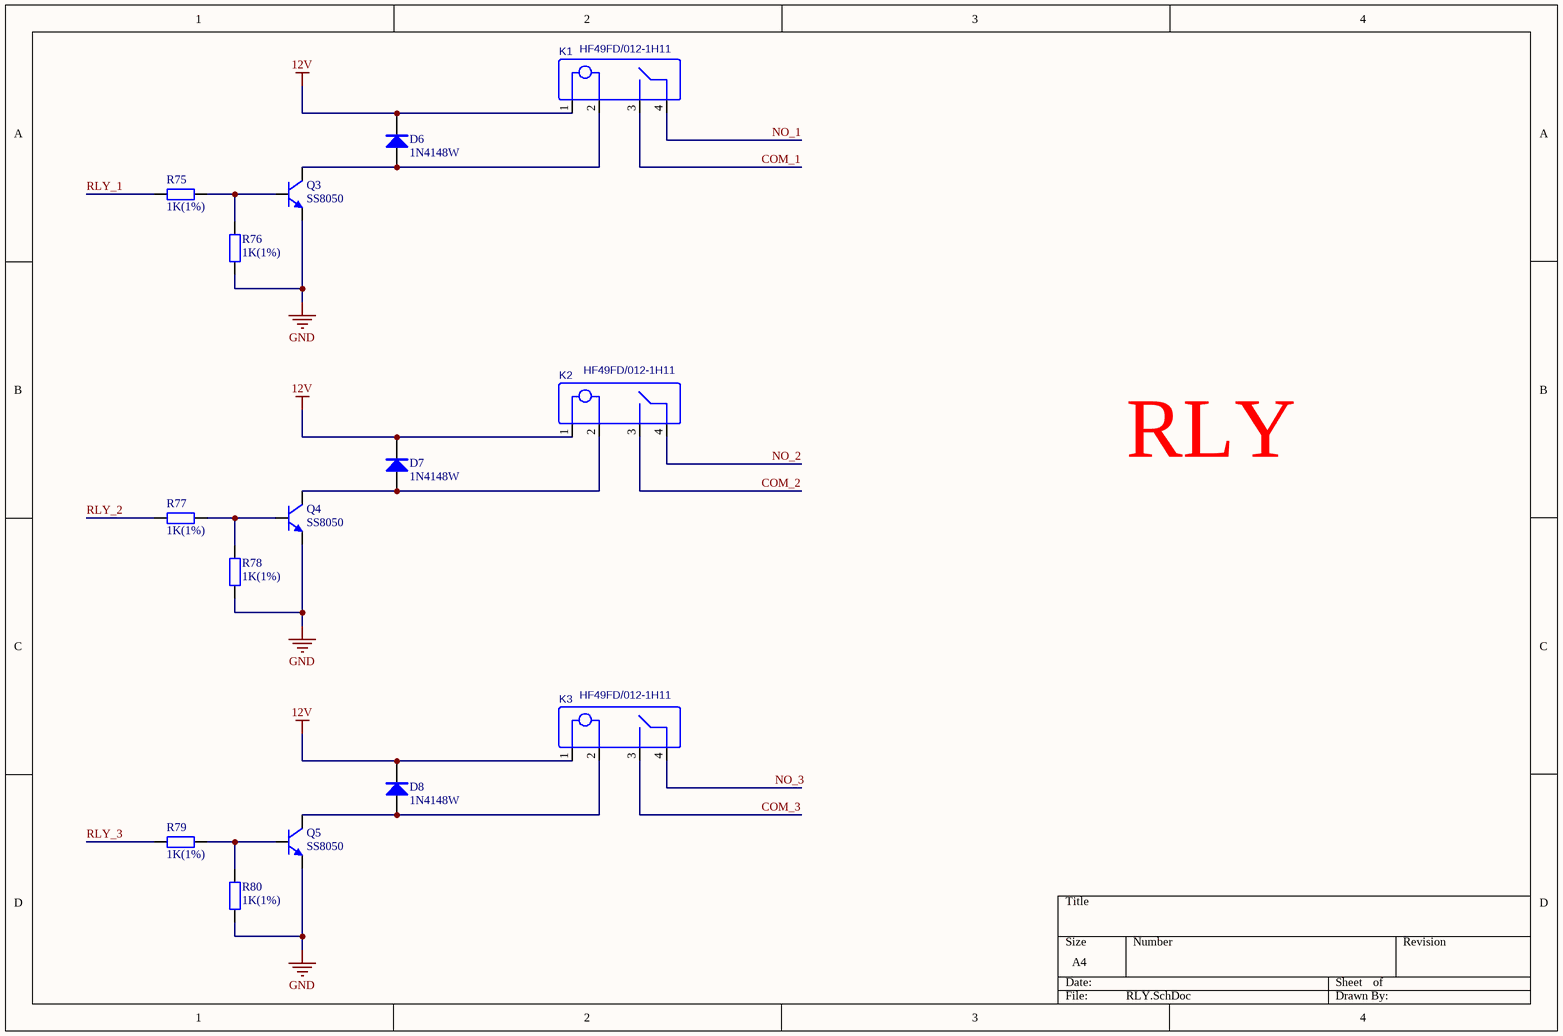
[diagram p7: RLY.SchDoc]

### Parts
D6  1N4148W  [SOD-123]
D7  1N4148W  [SOD-123]
D8  1N4148W  [SOD-123]
K1  HF49FD/012-1H11  [RELAY-TH_HF49FD-XXX-1H11-XXX]
K2  HF49FD/012-1H11  [RELAY-TH_HF49FD-XXX-1H11-XXX]
K3  HF49FD/012-1H11  [RELAY-TH_HF49FD-XXX-1H11-XXX]
Q3  SS8050  [SOT23-3N]
Q4  SS8050  [SOT23-3N]
Q5  SS8050  [SOT23-3N]
R75  1K(1%)  [R 0603_L]
R76  1K(1%)  [R 0603_L]
R77  1K(1%)  [R 0603_L]
R78  1K(1%)  [R 0603_L]
R79  1K(1%)  [R 0603_L]
R80  1K(1%)  [R 0603_L]

### Nets
12V: D6.2(K) D7.2(K) D8.2(K) K1.1 K2.1 K3.1
GND: Q3.2(E) Q4.2(E) Q5.2(E) R76.1 R78.1 R80.1
COM_1: K1.3
COM_2: K2.3
COM_3: K3.3
NO_1: K1.4
NO_2: K2.4
NO_3: K3.4
RLY_1: R75.2
RLY_2: R77.2
RLY_3: R79.2
NetD6_1: D6.1(A) K1.2 Q3.3(C)
NetD7_1: D7.1(A) K2.2 Q4.3(C)
NetD8_1: D8.1(A) K3.2 Q5.3(C)
NetQ3_1: Q3.1(B) R75.1 R76.2
NetQ4_1: Q4.1(B) R77.1 R78.2
NetQ5_1: Q5.1(B) R79.1 R80.2

### Notes on the sheet
- RLY

### Library data of the parts
D6-D8 = 1N4148: 高速开关二极管; 版权归属: 源创客; BOM名称: 高速开关二极管; 学习资源: www.ooocke.com
K1-K3 = HF49FD/012-1H11: BOM_Manufacturer: Xiamen Hongfa Electroacoustic; BOM_Manufacturer Part: HF49FD/012-1H12; Contributor: LCSC; BOM_Supplier: LCSC; BOM_Supplier Part: C399491; BOM_JLCPCB Part Class: Extended Part; spicePre: K; spiceSymbolName: HF49FD/012-1H12
Q3-Q5 = 8050-SMD: 高频放大-NPN型; 版权归属: 源创客; 属性: 40V 1.5A 1W 100MHZ; BOM名称: 高频放大-NPN型; 学习资源: www.ooocke.com
R75-R80 = R: 贴片电阻; 版权归属: 源创客; BOM名称: 贴片电阻; 学习资源: www.ooocke.com

## Sheet ETH.SchDoc
size A4; SheetNumber: 9; SheetTotal: 10
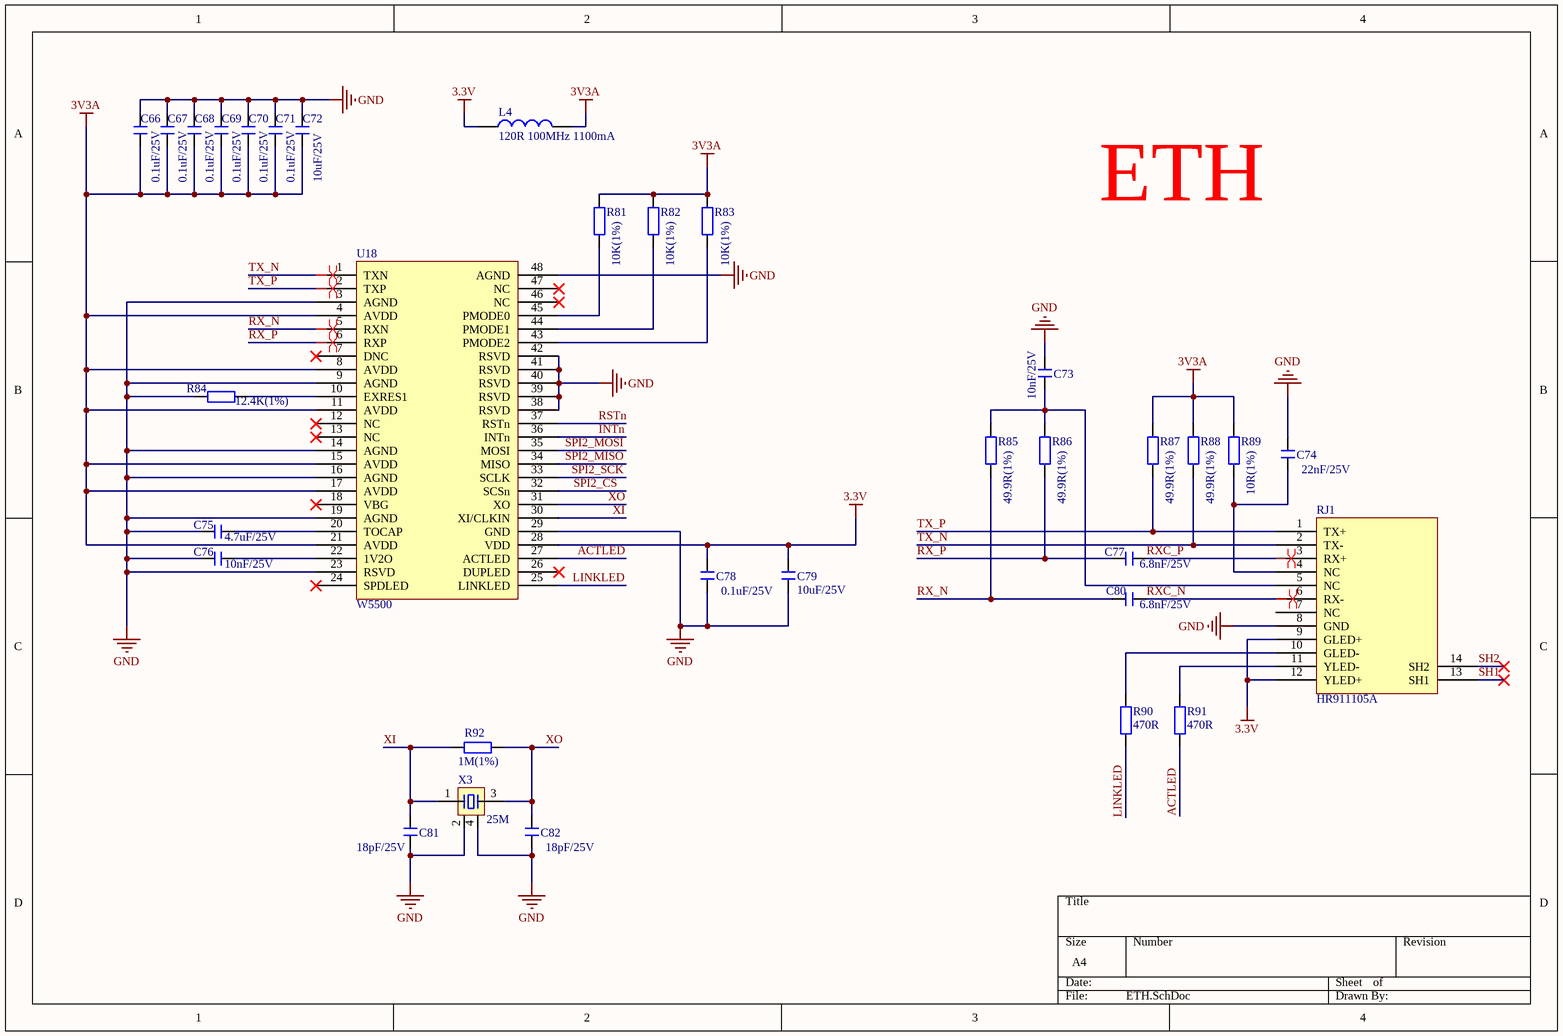
[diagram p8: ETH.SchDoc]

### Parts
C66  0.1uF/25V  [C 0603_L]
C67  0.1uF/25V  [C 0603_L]
C68  0.1uF/25V  [C 0603_L]
C69  0.1uF/25V  [C 0603_L]
C70  0.1uF/25V  [C 0603_L]
C71  0.1uF/25V  [C 0603_L]
C72  10uF/25V  [C 0603_L]
C73  10nF/25V  [C 0603_L]
C74  22nF/25V  [C 0603_L]
C75  4.7uF/25V  [C 0603_L]
C76  10nF/25V  [C 0603_L]
C77  6.8nF/25V  [C 0603_L]
C78  0.1uF/25V  [C 0603_L]
C79  10uF/25V  [C 0603_L]
C80  6.8nF/25V  [C 0603_L]
C81  18pF/25V  [C 0603_L]
C82  18pF/25V  [C 0603_L]
L4  120R 100MHz 1100mA  [L 0603]
R81  10K(1%)  [R 0603_L]
R82  10K(1%)  [R 0603_L]
R83  10K(1%)  [R 0603_L]
R84  12.4K(1%)  [R 0603_L]
R85  49.9R(1%)  [R 0603_L]
R86  49.9R(1%)  [R 0603_L]
R87  49.9R(1%)  [R 0603_L]
R88  49.9R(1%)  [R 0603_L]
R89  10R(1%)  [R 0603_L]
R90  470R  [R 0603_L]
R91  470R  [R 0603_L]
R92  1M(1%)  [R 0603_L]
RJ1  HR911105A  [RJ-45A12]
U18  W5500  [LQFP48 7X7_N]
X3  25M  [OSC 3225-4P]

### Nets
3.3V: C78.1 C79.1 L4.1 RJ1.9(GLED+) RJ1.12(YLED+) U18.28(VDD)
3V3A: C66.2 C67.2 C68.2 C69.2 C70.2 C71.2 C72.2 L4.2 R81.1 R82.1 R83.1 R87.1 R88.1 R89.1 U18.4(AVDD) U18.8(AVDD) U18.11(AVDD) U18.15(AVDD) U18.17(AVDD) U18.21(AVDD)
GND: C66.1 C67.1 C68.1 C69.1 C70.1 C71.1 C72.1 C73.1 C74.1 C75.2 C76.2 C78.2 C79.2 C81.2 C82.2 R84.2 RJ1.8(GND) U18.3(AGND) U18.9(AGND) U18.14(AGND) U18.16(AGND) U18.19(AGND) U18.23(RSVD) U18.29(GND) U18.38(RSVD) U18.39(RSVD) U18.40(RSVD) U18.41(RSVD) U18.42(RSVD) U18.48(AGND) X3.2 X3.4
ACTLED: R91.2 U18.27(ACTLED)
INTn: U18.36(INTn)
LINKLED: R90.2 U18.25(LINKLED)
RSTn: U18.37(RSTn)
RX_N: C80.1 R85.2 U18.5(RXN)
RX_P: C77.1 R86.2 U18.6(RXP)
RXC_N: C80.2 RJ1.6(RX-)
RXC_P: C77.2 RJ1.3(RX+)
SH1: RJ1.13(SH1)
SH2: RJ1.14(SH2)
SPI2_CS: U18.32(SCSn)
SPI2_MISO: U18.34(MISO)
SPI2_MOSI: U18.35(MOSI)
SPI2_SCK: U18.33(SCLK)
TX_N: R88.2 RJ1.2(TX-) U18.1(TXN)
TX_P: R87.2 RJ1.1(TX+) U18.2(TXP)
XI: C81.1 R92.2 U18.30(XI/CLKIN) X3.1
XO: C82.1 R92.1 U18.31(XO) X3.3
NetC73_2: C73.2 R85.1 R86.1 RJ1.5(NC)
NetC74_2: C74.2 R89.2 RJ1.4(NC)
NetC75_1: C75.1 U18.20(TOCAP)
NetC76_1: C76.1 U18.22(1V2O)
NetR81_2: R81.2 U18.45(PMODE0)
NetR82_2: R82.2 U18.44(PMODE1)
NetR83_2: R83.2 U18.43(PMODE2)
NetR84_1: R84.1 U18.10(EXRES1)
NetR90_1: R90.1 RJ1.10(GLED-)
NetR91_1: R91.1 RJ1.11(YLED-)

Not connected (* = marked no-connect by the designer): RJ1 7(NC); U18 7(DNC)* 12(NC)* 13(NC)* 18(VBG)* 24(SPDLED)* 26(DUPLED)* 46(NC)* 47(NC)*

### Layout directives
differential pair: RX_N, RX_P, RXC_N, RXC_P, TX_N, TX_P

### Notes on the sheet
- ETH

### Library data of the parts
C66-C82 = C: 无极性贴片电容; 版权归属: 源创客; BOM名称: 无极性贴片电容; 学习资源: www.ooocke.com
L4 = L: 磁珠 HH-1M1608-121JT; BOM名称: 小功率贴片电感; 版权归属: 源创客; 学习资源: www.ooocke.com
R81-R92 = R: 贴片电阻; 版权归属: 源创客; BOM名称: 贴片电阻; 学习资源: www.ooocke.com
RJ1 = HR911105A: 带灯以太网接口
X3 = XTAL-4P: 4脚无源晶振; 版权归属: 源创客; BOM名称: 4脚无源晶振; 学习资源: www.ooocke.com

## Sheet CONN.SchDoc
size A4; SheetNumber: 10; SheetTotal: 10
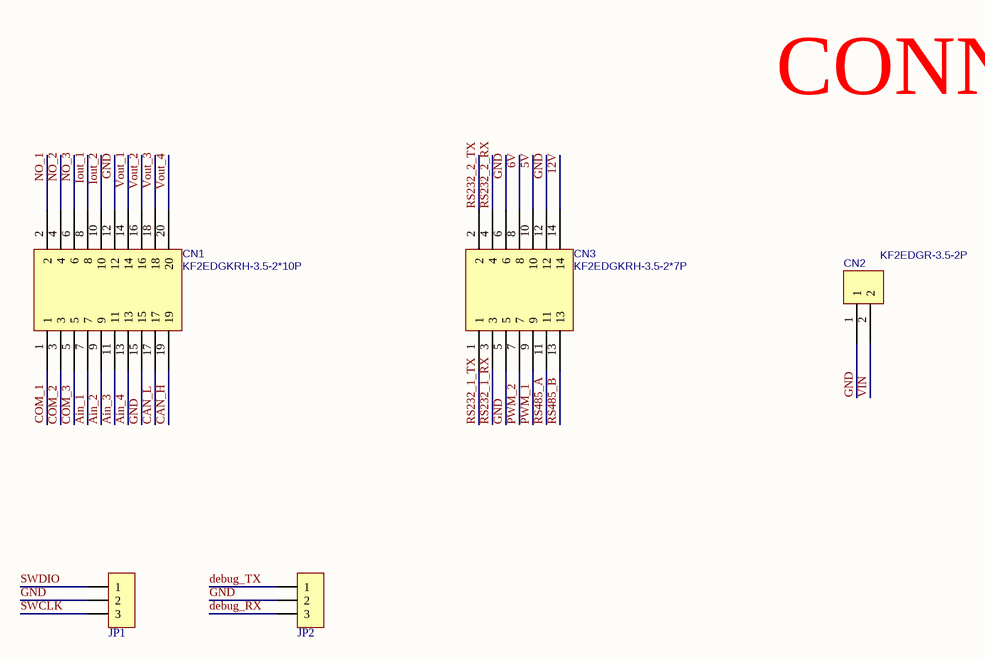
[diagram p9: CONN.SchDoc]

### Parts
CN1  KF2EDGKRH-3.5-2*10P  [CONN-TH_20P-P3.50_KEFA_KF2EDGKRH-3.5-2X10P]
CN2  KF2EDGR-3.5-2P  [CONN-TH_P3.50_KF2EDGR-3.5-2P]
CN3  KF2EDGKRH-3.5-2*7P  [CONN-TH_14P-P3.50_KEFA_KF2EDGKRH-3.5-2X7P]
JP1  HDR-1X3  [HDR2.54-LI-3P]  (value not drawn)
JP2  HDR-1X3  [HDR2.54-LI-3P]  (value not drawn)

### Nets
5V: CN3.10
6V: CN3.8
12V: CN3.14
GND: CN1.12 CN1.15 CN2.1 CN3.5 CN3.6 CN3.12 JP1.2 JP2.2
VIN: CN2.2
Ain_1: CN1.7
Ain_2: CN1.9
Ain_3: CN1.11
Ain_4: CN1.13
CAN_H: CN1.19
CAN_L: CN1.17
COM_1: CN1.1
COM_2: CN1.3
COM_3: CN1.5
debug_RX: JP2.3
debug_TX: JP2.1
Iout_1: CN1.8
Iout_2: CN1.10
NO_1: CN1.2
NO_2: CN1.4
NO_3: CN1.6
PWM_1: CN3.9
PWM_2: CN3.7
RS232_1_RX: CN3.3
RS232_1_TX: CN3.1
RS232_2_RX: CN3.4
RS232_2_TX: CN3.2
RS485_A: CN3.11
RS485_B: CN3.13
SWCLK: JP1.3
SWDIO: JP1.1
Vout_1: CN1.14
Vout_2: CN1.16
Vout_3: CN1.18
Vout_4: CN1.20

### Notes on the sheet
- CONN

### Library data of the parts
CN1 = KF2EDGKRH-3.5-2*10P: 20P 间距P=3.5mm / 插拔式接线端子; BOM_Manufacturer: KEFA(科发); Contributor: LCSC; BOM_Supplier: LCSC; BOM_Supplier Part: C2923169; BOM_Manufacturer Part: KF2EDGKRH-3.5-2*10P; spicePre: C; spiceSymbolName: KF2EDGKRH-3.5-2*10P
CN2 = KF2EDGR-3.5-2P: 3.5mm 排数:1 每排P数:2 弯针 / 插拔式接线端子; BOM_Manufacturer: Cixi Kefa Elec; Contributor: LCSC; BOM_Supplier: LCSC; BOM_Supplier Part: C441171; BOM_Manufacturer Part: KF2EDGR-3.5-2P; BOM_JLCPCB Part Class: Extended Part; spicePre: C; spiceSymbolName: KF2EDGR-3.5-2P
CN3 = KF2EDGKRH-3.5-2*7P: 14P 间距P=3.5mm / 插拔式接线端子; BOM_Manufacturer: KEFA(科发); Contributor: LCSC; BOM_Supplier: LCSC; BOM_Supplier Part: C2923166; BOM_Manufacturer Part: KF2EDGKRH-3.5-2*7P; spicePre: C; spiceSymbolName: KF2EDGKRH-3.5-2*7P_C2923166
JP1 JP2 = Header 3: 3P排针; BOM名称: 3P接插件; 版权归属: 源创客; 学习资源: www.ooocke.com

## Nets that join several sheets
3.3V: PWR (C16.2 V1.2), MCU (18 pins), Serial (5 pins), ETH (6 pins)
5V: PWR (5 pins), PWM (6 pins), Serial (C64.1 U16.3), CONN (CN3.10)
6V: PWR (E2.1 L2.2 R9.2), CONN (CN3.8)
12V: PWR (E3.1 L3.2 R13.2), Vout (U6.4 U7.4), Ain (U8.4), Iout (6 pins), RLY (6 pins), CONN (CN3.14)
GND: PWR (35 pins), MCU (23 pins), Vout (26 pins), Ain (17 pins), Iout (18 pins), PWM (14 pins), Serial (14 pins), RLY (6 pins), ETH (32 pins), CONN (8 pins)
VIN: PWR (11 pins), CONN (CN2.2)
Ain_1: Ain (C41.2 DR5.1 R41.2 R42.2), CONN (CN1.7)
Ain_2: Ain (C42.2 DR6.1 R44.2 R45.2), CONN (CN1.9)
Ain_3: Ain (C43.2 DR7.1 R47.2 R48.2), CONN (CN1.11)
Ain_4: Ain (C44.2 DR8.1 R50.2 R51.2), CONN (CN1.13)
AV_1: MCU (U1.22), Ain (U8.1 U8.2)
AV_2: MCU (U1.23), Ain (U8.6 U8.7)
AV_3: MCU (U1.20), Ain (U8.8 U8.9)
AV_4: MCU (U1.21), Ain (U8.13 U8.14)
CAN_H: Serial (D9.2 R71.2 U16.7), CONN (CN1.19)
CAN_L: Serial (D9.1 R71.1 U16.6), CONN (CN1.17)
CAN_RX: MCU (U1.44), Serial (U16.4)
CAN_TX: MCU (U1.45), Serial (U16.1)
COM_1: RLY (K1.3), CONN (CN1.1)
COM_2: RLY (K2.3), CONN (CN1.3)
COM_3: RLY (K3.3), CONN (CN1.5)
debug_RX: MCU (U1.52), CONN (JP2.3)
debug_TX: MCU (U1.51), CONN (JP2.1)
INTn: MCU (U1.41), ETH (U18.36)
Iout_1: Iout (C47.1 DR9.1 R56.2 R57.1), CONN (CN1.8)
Iout_2: Iout (C50.1 DR10.1 R62.2 R63.1), CONN (CN1.10)
Ipwm_1: MCU (U1.15), Iout (U9.3)
Ipwm_2: MCU (U1.14), Iout (U11.3)
Mpwm_1: MCU (U1.29), PWM (R66.2)
Mpwm_2: MCU (U1.30), PWM (R69.2)
NO_1: RLY (K1.4), CONN (CN1.2)
NO_2: RLY (K2.4), CONN (CN1.4)
NO_3: RLY (K3.4), CONN (CN1.6)
PWM_1: PWM (C53.2 R65.1), CONN (CN3.9)
PWM_2: PWM (C57.2 R68.1), CONN (CN3.7)
RD: MCU (U1.58), Serial (U17.2 U17.3)
RLY_1: MCU (U1.9), RLY (R75.2)
RLY_2: MCU (U1.10), RLY (R77.2)
RLY_3: MCU (U1.11), RLY (R79.2)
RS232_1_RX: Serial (D11.2 U15.13), CONN (CN3.3)
RS232_1_TX: Serial (D11.1 U15.14), CONN (CN3.1)
RS232_2_RX: Serial (D12.2 U15.8), CONN (CN3.4)
RS232_2_TX: Serial (D12.1 U15.7), CONN (CN3.2)
RS485_A: Serial (D10.2 R72.1 R73.1 U17.6), CONN (CN3.11)
RS485_B: Serial (D10.1 R73.2 R74.2 U17.7), CONN (CN3.13)
RSTn: MCU (U1.28), ETH (U18.37)
SPI2_CS: MCU (U1.33), ETH (U18.32)
SPI2_MISO: MCU (U1.35), ETH (U18.34)
SPI2_MOSI: MCU (U1.36), ETH (U18.35)
SPI2_SCK: MCU (U1.34), ETH (U18.33)
SWCLK: MCU (U1.49), CONN (JP1.3)
SWDIO: MCU (U1.46), CONN (JP1.1)
USART1_RX: MCU (U1.43), Serial (U17.1)
USART1_TX: MCU (U1.42), Serial (U17.4)
USART2_RX: MCU (U1.17), Serial (U15.9)
USART2_TX: MCU (U1.16), Serial (U15.10)
USART5_RX: MCU (U1.54), Serial (U15.12)
USART5_TX: MCU (U1.53), Serial (U15.11)
Vfb_1: MCU (U1.25), Vout (R19.1 R22.2)
Vfb_2: MCU (U1.24), Vout (R25.1 R28.2)
Vfb_3: MCU (U1.27), Vout (R31.1 R34.2)
Vfb_4: MCU (U1.26), Vout (R37.1 R40.2)
Vout_1: Vout (DR1.1 R18.1 R19.2 U6.7), CONN (CN1.14)
Vout_2: Vout (DR2.1 R24.1 R25.2 U6.14), CONN (CN1.16)
Vout_3: Vout (DR3.1 R30.1 R31.2 U7.7), CONN (CN1.18)
Vout_4: Vout (DR4.1 R36.1 R37.2 U7.14), CONN (CN1.20)
Vpwm_1: MCU (U1.37), Vout (R93.2 U6.3)
Vpwm_2: MCU (U1.38), Vout (R94.2 U6.10)
Vpwm_3: MCU (U1.39), Vout (R95.2 U7.3)
Vpwm_4: MCU (U1.40), Vout (R96.2 U7.10)